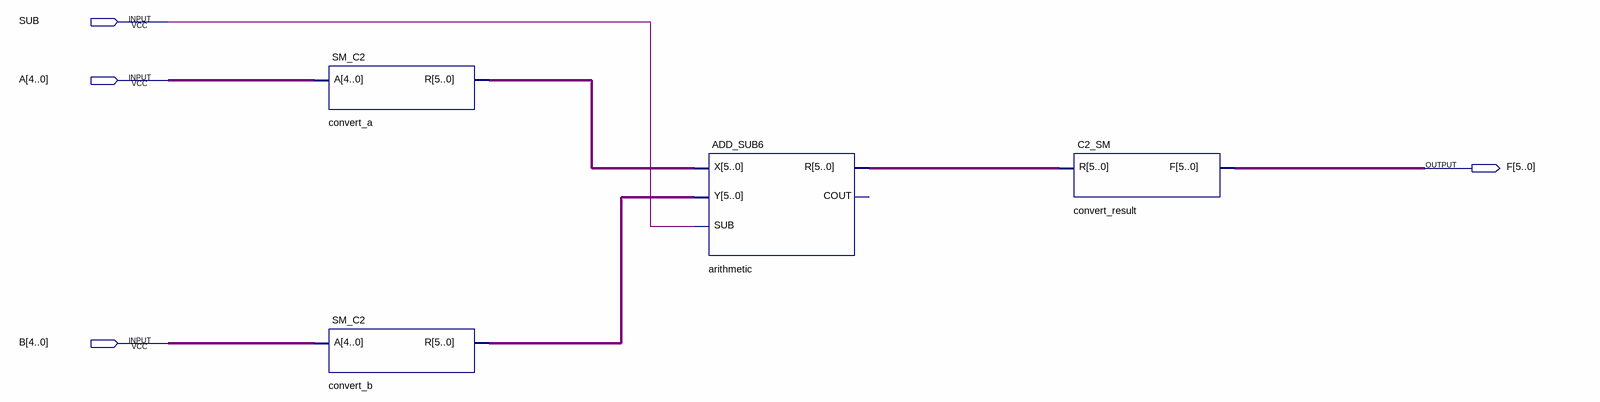
[diagram p0: schematic sheet]
// Quartus schematic ARITMETICA.bdf as structural Verilog: 4 symbols, 4 pins
module ARITMETICA (
  input  SUB,
  input  [4:0] A,
  input  [4:0] B,
  output [5:0] F
);

  wire [5:0] arithmetic_r, convert_a_r, convert_b_r;

  SM_C2 convert_a (.A(A), .R(convert_a_r));
  SM_C2 convert_b (.A(B), .R(convert_b_r));
  ADD_SUB6 arithmetic (.X(convert_a_r), .Y(convert_b_r), .SUB(SUB), .R(arithmetic_r));  // open: COUT
  C2_SM convert_result (.R(arithmetic_r), .F(F));
endmodule
